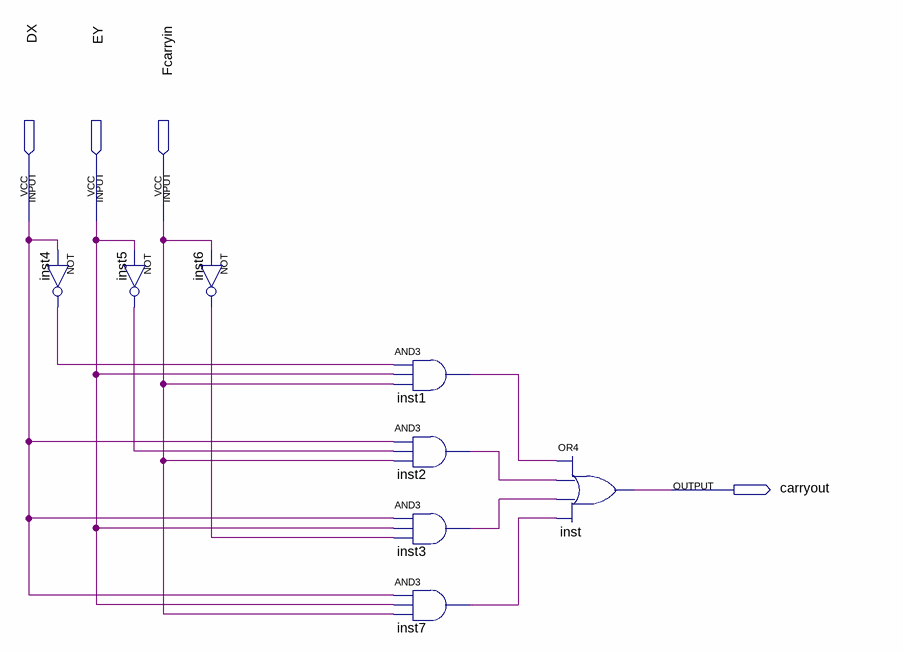
[diagram p0: schematic sheet]
// Quartus schematic carry.bdf as structural Verilog: 8 symbols, 4 pins
module carry (
  input  DX,
  input  EY,
  input  Fcarryin,
  output carryout
);

  wire inst1_out, inst2_out, inst3_out, inst4_out, inst5_out, inst6_out, inst7_out;

  not inst4 (inst4_out, DX);
  not inst5 (inst5_out, EY);
  not inst6 (inst6_out, Fcarryin);
  and inst1 (inst1_out, inst4_out, EY, Fcarryin);
  and inst2 (inst2_out, DX, inst5_out, Fcarryin);
  and inst3 (inst3_out, DX, EY, inst6_out);
  and inst7 (inst7_out, DX, EY, Fcarryin);
  or inst (carryout, inst1_out, inst2_out, inst3_out, inst7_out);
endmodule
